# EAGLE design RS485_RELAY_V1 (EAGLE 6.3)
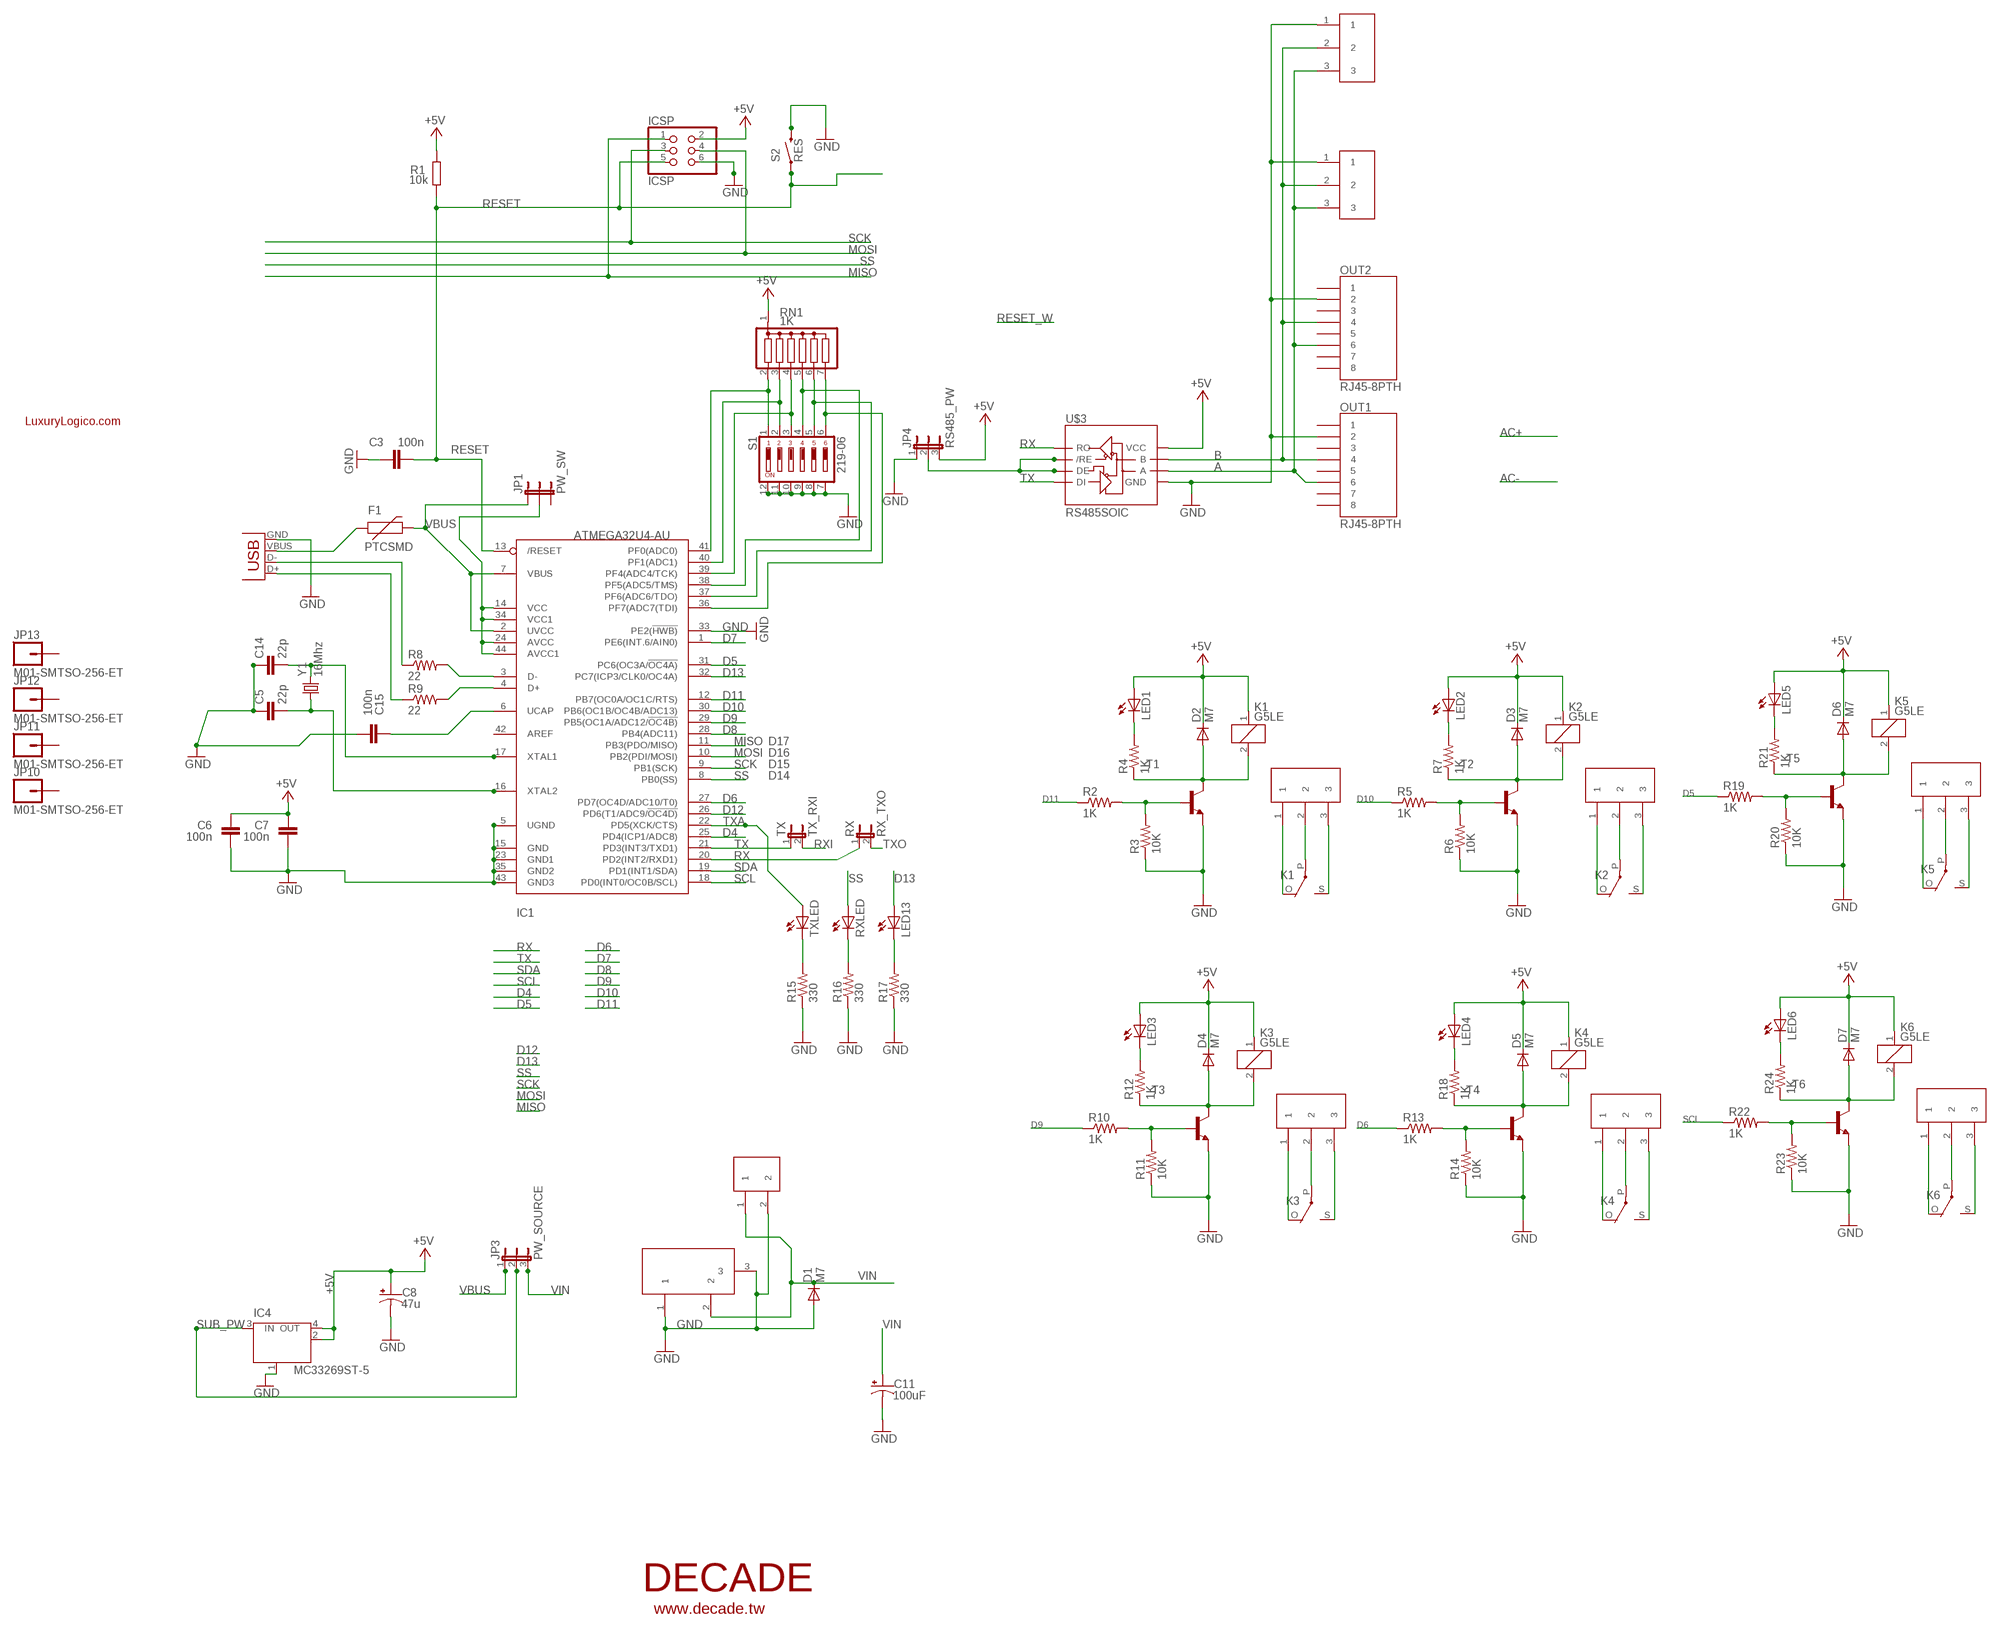
[diagram p0: schematic, sheet 1]

## Parts
C3  100n  C-EUC0603  [C0603-ROUND]
C5  22p  CAP0805  [0805]
C6  100n  C-EUC0603  [C0603-ROUND]
C7  100n  C-EUC0603  [C0603-ROUND]
C8  47u  CAP_POLE  [PANASONIC_E]
C11  100uF  CAP_POLE  [PANASONIC_E]
C14  22p  CAP0805  [0805]
C15  100n  C-EUC0603  [C0603-ROUND]
D1  M7  DIODE-SMB  [SMB]
D2  M7  DIODE-SMB  [SMB]
D3  M7  DIODE-SMB  [SMB]
D4  M7  DIODE-SMB  [SMB]
D5  M7  DIODE-SMB  [SMB]
D6  M7  DIODE-SMB  [SMB]
D7  M7  DIODE-SMB  [SMB]
F1  PTCSMD  [PTC-1206]
IC1  ATMEGA32U4-AU  [TQFP44]
IC4  MC33269ST-5  MC33269ST-3.3T3  [SOT223]
ICSP  ICSP  PINHD-2X3  [2X03]
JP1  PW_SW  JUMPER-3SMD  [SJ_3]
JP3  PW_SOURCE  JP2E  [JP2]
JP4  RS485_PW  JP2E  [JP2]
JP10  M01-SMTSO-256-ET  [SMTSO-256-ET]
JP11  M01-SMTSO-256-ET  [SMTSO-256-ET]
JP12  M01-SMTSO-256-ET  [SMTSO-256-ET]
JP13  M01-SMTSO-256-ET  [SMTSO-256-ET]
K1  G5LE  [G5LE]
K2  G5LE  [G5LE]
K3  G5LE  [G5LE]
K4  G5LE  [G5LE]
K5  G5LE  [G5LE]
K6  G5LE  [G5LE]
LED1  LEDCHIPLED_0805  [CHIPLED_0805]
LED2  LEDCHIPLED_0805  [CHIPLED_0805]
LED3  LEDCHIPLED_0805  [CHIPLED_0805]
LED4  LEDCHIPLED_0805  [CHIPLED_0805]
LED5  LEDCHIPLED_0805  [CHIPLED_0805]
LED6  LEDCHIPLED_0805  [CHIPLED_0805]
LED13  LEDCHIPLED_0805  [CHIPLED_0805]
OUT1  RJ45-8PTH  [RJ45-8]
OUT2  RJ45-8PTH  [RJ45-8]
R1  10k  R-EU_0603-RND  [R0603-ROUND]
R2  1K  RESISTOR0805-RES  [0805]
R3  10K  RESISTOR0805-RES  [0805]
R4  1K  RESISTOR0805-RES  [0805]
R5  1K  RESISTOR0805-RES  [0805]
R6  10K  RESISTOR0805-RES  [0805]
R7  1K  RESISTOR0805-RES  [0805]
R8  22  RESISTOR0805-RES  [0805]
R9  22  RESISTOR0805-RES  [0805]
R10  1K  RESISTOR0805-RES  [0805]
R11  10K  RESISTOR0805-RES  [0805]
R12  1K  RESISTOR0805-RES  [0805]
R13  1K  RESISTOR0805-RES  [0805]
R14  10K  RESISTOR0805-RES  [0805]
R15  330  RESISTOR0805-RES  [0805]
R16  330  RESISTOR0805-RES  [0805]
R17  330  RESISTOR0805-RES  [0805]
R18  1K  RESISTOR0805-RES  [0805]
R19  1K  RESISTOR0805-RES  [0805]
R20  10K  RESISTOR0805-RES  [0805]
R21  1K  RESISTOR0805-RES  [0805]
R22  1K  RESISTOR0805-RES  [0805]
R23  10K  RESISTOR0805-RES  [0805]
R24  1K  RESISTOR0805-RES  [0805]
RN1  1K  G06R  [SIL7]
RX  RX_TXO  JP1E  [JP1]
RXLED  LEDCHIPLED_0805  [CHIPLED_0805]
S1  219-06  [CTS-219-06]
S2  RES  SWITCH-MOMENTARY-2-SMD-1101NE  [TACTILE-SWITCH-1101NE]
T1  -NPN-SOT23-EBC  [SOT23-EBC]
T2  -NPN-SOT23-EBC  [SOT23-EBC]
T3  -NPN-SOT23-EBC  [SOT23-EBC]
T4  -NPN-SOT23-EBC  [SOT23-EBC]
T5  -NPN-SOT23-EBC  [SOT23-EBC]
T6  -NPN-SOT23-EBC  [SOT23-EBC]
TX  TX_RXI  JP1E  [JP1]
TXLED  LEDCHIPLED_0805  [CHIPLED_0805]
U$1  DECADE-5MM-CON-1X3  [DECADE-5MM-CON-1X3]
U$2  DECADE-5MM-CON-1X3  [DECADE-5MM-CON-1X3]
U$3  RS485SOIC  [SO08]
U$4  DECADE-5MM-CON-1X3  [DECADE-5MM-CON-1X3]
U$5  DECADE-5MM-CON-1X3  [DECADE-5MM-CON-1X3]
U$6  DECADE-5MM-CON-1X3  [DECADE-5MM-CON-1X3]
U$7  DECADE-5MM-CON-1X3  [DECADE-5MM-CON-1X3]
U$8  DECADE-5MM-CON-1X3  [DECADE-5MM-CON-1X3]
U$9  DECADE-5MM-CONN  [DECADE-5MM-CON-1X2]
U$10  DECADE-LOGO-SMALL  [DECADE-LOGO-SMALL]
U$11  DECADE-5MM-CON-1X3  [DECADE-5MM-CON-1X3]
U$13  LL-LUXURYLOGICO.COM  [DECADE-LL-LOGO-SMALL]
X1  DC21MMX  [DC-21MM]
X3  USBOLD  [USB-MINIB-OLD]
Y1  16Mhz  CRYSTAL5X3  [CRYSTAL-SMD-5X3]

## Nets
+5V [power]: C6.1 C7.1 C8.+ D2.C D3.C D4.C D5.C D6.C D7.C IC4.2(OUT) IC4.4(OUT) ICSP.2 JP4.3 K1.1 K2.1 K3.1 K4.1 K5.1 K6.1 LED1.A LED2.A LED3.A LED4.A LED5.A LED6.A R1.2 RN1.1 U$3.8(VCC)
A: OUT1.6 OUT2.6 U$1.3 U$3.6(A) U$11.3
B: OUT1.4 OUT2.4 U$1.2 U$3.7(B) U$11.2
D4: IC1.25(PD4(ICP1/ADC8))
D5: IC1.31(PC6(OC3A/!OC4A)) R19.1
D6: IC1.27(PD7(OC4D/ADC10/T0)) R13.1
D7: IC1.1(PE6(INT.6/AIN0))
D8: IC1.28(PB4(ADC11))
D9: IC1.29(PB5(OC1A/ADC12/!OC4B)) R10.1
D10: IC1.30(PB6(OC1B/OC4B/ADC13)) R5.1
D11: IC1.12(PB7(OC0A/OC1C/RTS)) R2.1
D12: IC1.26(PD6(T1/ADC9/!OC4D))
D13: IC1.32(PC7(ICP3/CLK0/OC4A)) LED13.A
GND [power]: C3.2 C5.1 C6.2 C7.2 C8.- C11.- C14.1 C15.2 D1.A IC1.5(UGND) IC1.15(GND) IC1.23(GND1) IC1.33(PE2(!HWB)) IC1.35(GND2) IC1.43(GND3) IC4.1(GND/ADJ) ICSP.6 JP4.1 OUT1.2 OUT2.2 R3.1 R6.1 R11.1 R14.1 R15.1 R16.1 R17.1 R20.1 R23.1 S1.7 S1.8 S1.9 S1.10 S1.11 S1.12 S2.P$2 T1.E T2.E T3.E T4.E T5.E T6.E U$1.1 U$3.5(GND) U$9.2 U$11.1 X1.1 X1.3 X3.GND
MISO: IC1.11(PB3(PDO/MISO)) ICSP.1
MOSI: IC1.10(PB2(PDI/MOSI)) ICSP.4
N$1: K1.P(2:P) U$2.2
N$2: LED1.C R4.2
N$3: D2.A K1.2 R4.1 T1.C
N$4: K1.O(2:O) U$2.1
N$5: R2.2 R3.2 T1.B
N$6: C5.2 IC1.16(XTAL2) Y1.1
N$7: C14.2 IC1.17(XTAL1) Y1.3
N$8: K1.S(2:S) U$2.3
N$9: LED2.C R7.2
N$10: D3.A K2.2 R7.1 T2.C
N$11: IC1.3(D-) R8.2
N$12: IC1.4(D+) R9.2
N$13: R8.1 X3.D-
N$14: R9.1 X3.D+
N$15: F1.1 X3.VBUS
N$16: R15.2 TXLED.C
N$17: R5.2 R6.2 T2.B
N$18: C15.1 IC1.6(UCAP)
N$19: IC1.14(VCC) IC1.24(AVCC) IC1.34(VCC1) IC1.44(AVCC1) JP1.2
N$20: K2.P(2:P) U$4.2
N$21: JP4.2 U$3.2(/RE) U$3.3(DE)
N$22: K2.O(2:O) U$4.1
N$23: K2.S(2:S) U$4.3
N$24: LED3.C R12.2
N$25: D4.A K3.2 R12.1 T3.C
N$26: R10.2 R11.2 T3.B
N$27: K3.P(2:P) U$5.2
N$28: K3.O(2:O) U$5.1
N$29: K3.S(2:S) U$5.3
N$30: LED4.C R18.2
N$31: D5.A K4.2 R18.1 T4.C
N$32: R13.2 R14.2 T4.B
N$33: K4.P(2:P) U$6.2
N$34: K4.O(2:O) U$6.1
N$35: K4.S(2:S) U$6.3
N$36: LED5.C R21.2
N$37: R16.2 RXLED.C
N$38: LED13.C R17.2
N$39: D6.A K5.2 R21.1 T5.C
N$40: IC1.41(PF0(ADC0)) RN1.2 S1.1
N$41: IC1.40(PF1(ADC1)) RN1.3 S1.2
N$42: IC1.39(PF4(ADC4/TCK)) RN1.4 S1.3
N$43: IC1.38(PF5(ADC5/TMS)) RN1.5 S1.4
N$44: IC1.37(PF6(ADC6/TDO)) RN1.6 S1.5
N$45: IC1.36(PF7(ADC7(TDI)) RN1.7 S1.6
N$46: R19.2 R20.2 T5.B
N$47: K5.P(2:P) U$7.2
N$48: K5.O(2:O) U$7.1
N$49: K5.S(2:S) U$7.3
N$50: LED6.C R24.2
N$51: D7.A K6.2 R24.1 T6.C
N$52: R22.2 R23.2 T6.B
N$53: K6.P(2:P) U$8.2
N$54: K6.O(2:O) U$8.1
N$55: K6.S(2:S) U$8.3
RESET: C3.1 IC1.13(/RESET) ICSP.5 R1.1 S2.P$1
RX: IC1.20(PD2(INT2/RXD1)) RX.1 U$3.1(RO)
RXI: TX.2
SCK: IC1.9(PB1(SCK)) ICSP.3
SCL: IC1.18(PD0(INT0/OC0B/SCL)) R22.1
SDA: IC1.19(PD1(INT1/SDA))
SS: IC1.8(PB0(SS)) RXLED.A
SUB_PW [VIN]: IC4.3(IN) JP3.2
TX: IC1.21(PD3(INT3/TXD1)) TX.1 U$3.4(DI)
TXA: IC1.22(PD5(XCK/CTS)) TXLED.A
TXO: RX.2
VBUS: F1.2 IC1.2(UVCC) IC1.7(VBUS) JP1.1 JP3.1
VIN [VIN]: C11.+ D1.C JP3.3 U$9.1 X1.2
Unconnected: IC1.42(AREF) JP1.3 JP10.P$1 JP11.P$1 JP12.P$1 JP13.P$1 OUT1.1 OUT1.3 OUT1.5 OUT1.7 OUT1.8 OUT2.1 OUT2.3 OUT2.5 OUT2.7 OUT2.8

## Notes on the sheet
- D17
- D16
- D15
- D14

## Library data of the parts
C3 C6 C7 C15 = SmartPrj:C-EU: CAPACITOR, European symbol
C5 C14 = SparkFun-Passives:CAP: Capacitor Standard 0603 ceramic capacitor, and 0.1" leaded capacitor.
C8 C11 = SparkFun-Passives:CAP_POL: Capacitor Polarized These are standard SMD and PTH capacitors. Normally 10uF, 47uF, and 100uF in electrolytic and tantalum varieties. Always verify the external diameter of the through hole cap, it varies with capacity, voltage, and manufacturer. The EIA devices should be standard.
D1-D7 = diode:DIODE-: DIODE
F1 = SparkFun-PowerIC:PTC: Resettable Fuse PTC Resettable Fuse. Spark Fun Electronics SKU : COM-08357
IC1 = adafruit:ATMEGA32U4: http://www.ladyada.net/library/eagle
IC4 = linear:MC33269ST*: Adjustable Output Low Dropout Voltage Regulator 800 mA Source: http://www.onsemi.com/pub/Collateral/MC33269-D.PDF
ICSP = pinhead:PINHD-2X3: PIN HEADER
JP1 = SparkFun-Passives:JUMPER-3
JP3 JP4 = jumper:JP2E: JUMPER
JP10-JP13 = SparkFun-Connectors:M01: Header 1 Standard 1-pin 0.1" header. Use with straight break away headers (SKU : PRT-00116), right angle break away headers (PRT-00553), swiss pins (PRT-00743), machine pins (PRT-00117), and female headers (PRT-00115).
K1-K6 = relay:G5LE: RELAY 1 x switch, 10 A/120 V AC, 8 A/30 V DC, Omron; OC_FARNELL: unknown; OC_NEWARK: unknown
LED1-LED6 LED13 RXLED TXLED = led:LED: LED OSRAM: - CHIPLED LG R971, LG N971, LY N971, LG Q971, LY Q971, LO R971, LY R971 LH N974, LH R974 LS Q976, LO Q976, LY Q976 LO Q996 - Hyper CHIPLED LW Q18S LB Q993, LB Q99A, LB R99A - SideLED LS A670, LO A670, LY A670, LG A670, LP A670 LB A673, LV A673, LT A673, LW A673 LH A674 LY A675 LS A676, LA A676, LO A676, LY A676, LW A676 LS A679, LY A679, LG A679 - Hyper Micro SIDELED® LS Y876, LA Y876, LO Y876, LY Y876 LT Y87S - SmartLED LW L88C, LW L88S LB L89C, LB L89S, LG L890 LS L89K, LO L89K, LY L89K LS L896, LA L896, LO L896, LY L896 - TOPLED LS T670, LO T670, LY T670, LG T670, LP T670 LSG T670, LSP T670, LSY T670, LOP T670, LYG T670 LG T671, LOG T671, LSG T671 LB T673, LV T673, LT T673, LW T673 LH T674 LS T676, LA T676, LO T676, LY T676, LB T676, LH T676, LSB T676, LW T676 LB T67C, LV T67C, LT T67C, LS T67K, LO T67K, LY T67K, LW E67C LS E67B, LA E67B, LO E67B, LY E67B, LB E67C, LV E67C, LT E67C LW T67C LS T679, LY T679, LG T679 LS T770, LO T770, LY T770, LG T770, LP T770 LB T773, LV T773, LT T773, LW T773 LH T774 LS E675, LA E675, LY E675, LS T675 LS T776, LA T776, LO T776, LY T776, LB T776 LHGB T686 LT T68C, LB T68C - Hyper Mini TOPLED® LB M676 - Mini TOPLED Santana® LG M470 LS M47K, LO M47K, LY M47K Source: http://www.osram.convergy.de LUXEON: - LUMILED® LXK2-PW12-R00, LXK2-PW12-S00, LXK2-PW14-U00, LXK2-PW14-V00 LXK2-PM12-R00, LXK2-PM12-S00, LXK2-PM14-U00 LXK2-PE12-Q00, LXK2-PE12-R00, LXK2-PE12-S00, LXK2-PE14-T00, LXK2-PE14-U00 LXK2-PB12-K00, LXK2-PB12-L00, LXK2-PB12-M00, LXK2-PB14-N00, LXK2-PB14-P00, LXK2-PB14-Q00 LXK2-PR12-L00, LXK2-PR12-M00, LXK2-PR14-Q00, LXK2-PR14-R00 LXK2-PD12-Q00, LXK2-PD12-R00, LXK2-PD12-S00 LXK2-PH12-R00, LXK2-PH12-S00 LXK2-PL12-P00, LXK2-PL12-Q00, LXK2-PL12-R00 Source: www.luxeon.com KINGBRIGHT: KA-3528ASYC Source: www.kingbright.com
OUT1 OUT2 = SparkFun-Connectors:RJ45-8: RJ45 Jack Simple RJ45, 8-pin connection - connector for common Cat5, Cat5e, and Cat6 Ethernet cables. Footprint not yet proven in production. Connector sku is PRT-00643; Breakout PCB sku is BOB-00716.
R1 = SmartPrj:R-EU_: RESISTOR, European symbol
R2 R3 R5 R6 R10 R11 R13 R14 R19 R20 R22 R23 = SparkFun-Resistors:RESISTOR: Resistor Basic schematic elements and footprints for 0603, 1206, and PTH resistors.
R4 R7-R9 R12 R15-R18 R21 R24 = SparkFun-Passives:RESISTOR: Resistor Basic schematic elements and footprints for 0603, 1206, and PTH resistors.
RN1 = resistor-sil:G06R: SIL RESISTOR; OC_FARNELL: unknown; OC_NEWARK: unknown
RX TX = jumper:JP1E: JUMPER
S1 = switch-dil:219-06*: Surface Mount DIP Switch Series 219 SMT CTS Electronic Components Sourc: www.ctscorp.com; OC_FARNELL: unknown; OC_NEWARK: unknown
S2 = SparkFun-Electromechanical:SWITCH-MOMENTARY-2: Various NO switches- pushbuttons, reed, etc
T1-T6 = transistor:*-NPN-: NPN Transistror BF959 corrected 2008.03.06
U$1 U$2 U$4-U$8 U$11 = DECADE-libraries:DECADE-5MM-CON-1X3
U$3 = SparkFun-DigitalIC:RS485: RS485 transceiver
U$9 = DECADE-libraries:DECADE-5MM-CONN
U$10 = DECADE-libraries:DECADE-LOGO-SMALL
U$13 = DECADE-libraries:LL-LUXURYLOGICO.COM
X1 = powersupply:DC21MM
X3 = SparkFun-Connectors:USB: USB Connectors USB-B-PTH is fully proven SKU : PRT-00139 USB-miniB is fully proven SKU : PRT-00587 USB-A-PCB is untested. USB-A-H is throughly reviewed, but untested. Spark Fun Electronics SKU : PRT-00437 USB-B-SMT is throughly reviewed, but untested. Needs silkscreen touching up. USB-A-S has not been used/tested USB-MB-H has not been used/tested
Y1 = SparkFun-FreqCtrl:CRYSTAL: Various standard crystals. Proven footprints. Spark Fun Electronics SKU : COM-00534

## Net classes
0 default: width 0.152 mm, drill 0.152 mm, clearance 0.152 mm
1 power: width 0.152 mm, drill 0.152 mm, clearance 0.152 mm
2 VIN: width 0.305 mm, drill 0.152 mm, clearance 0.305 mm

## Board
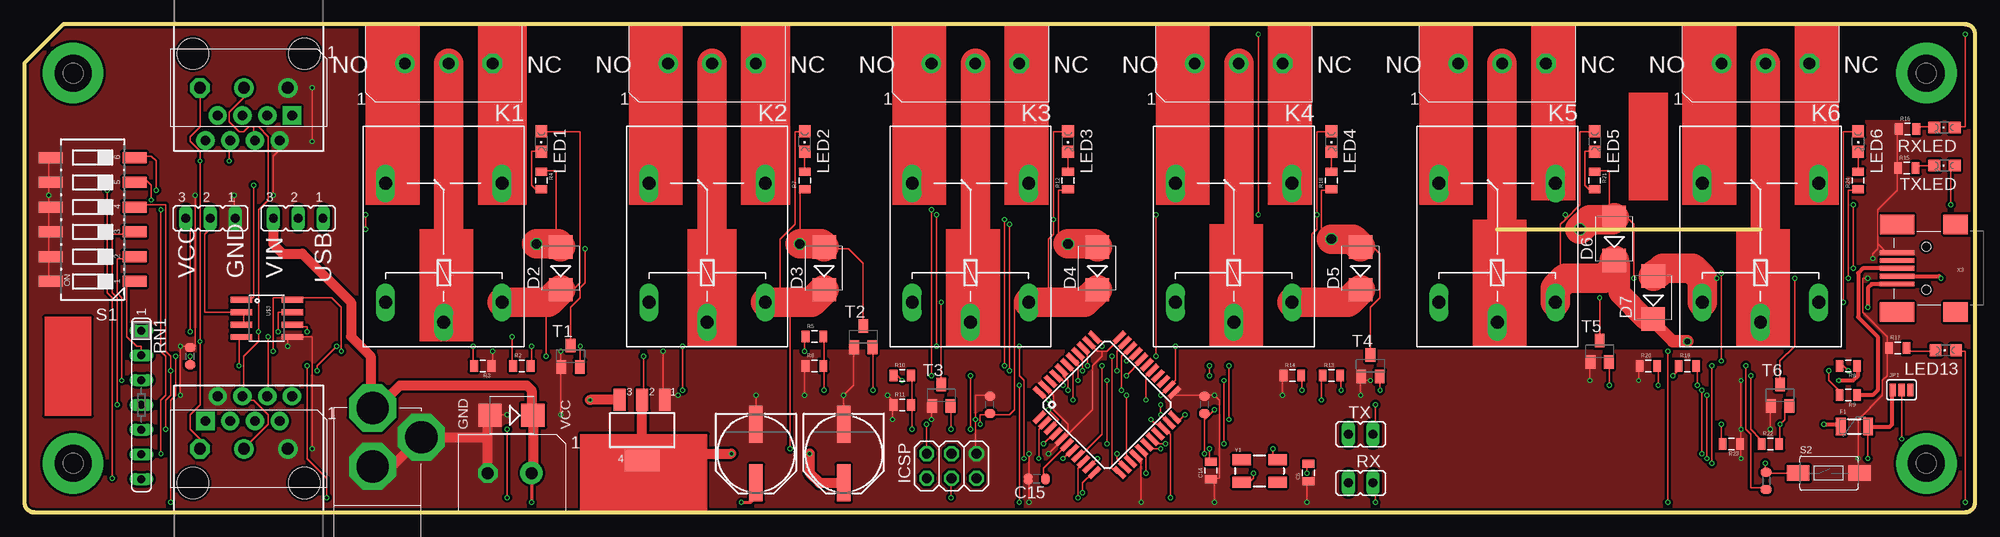
[diagram p1: board, top side]
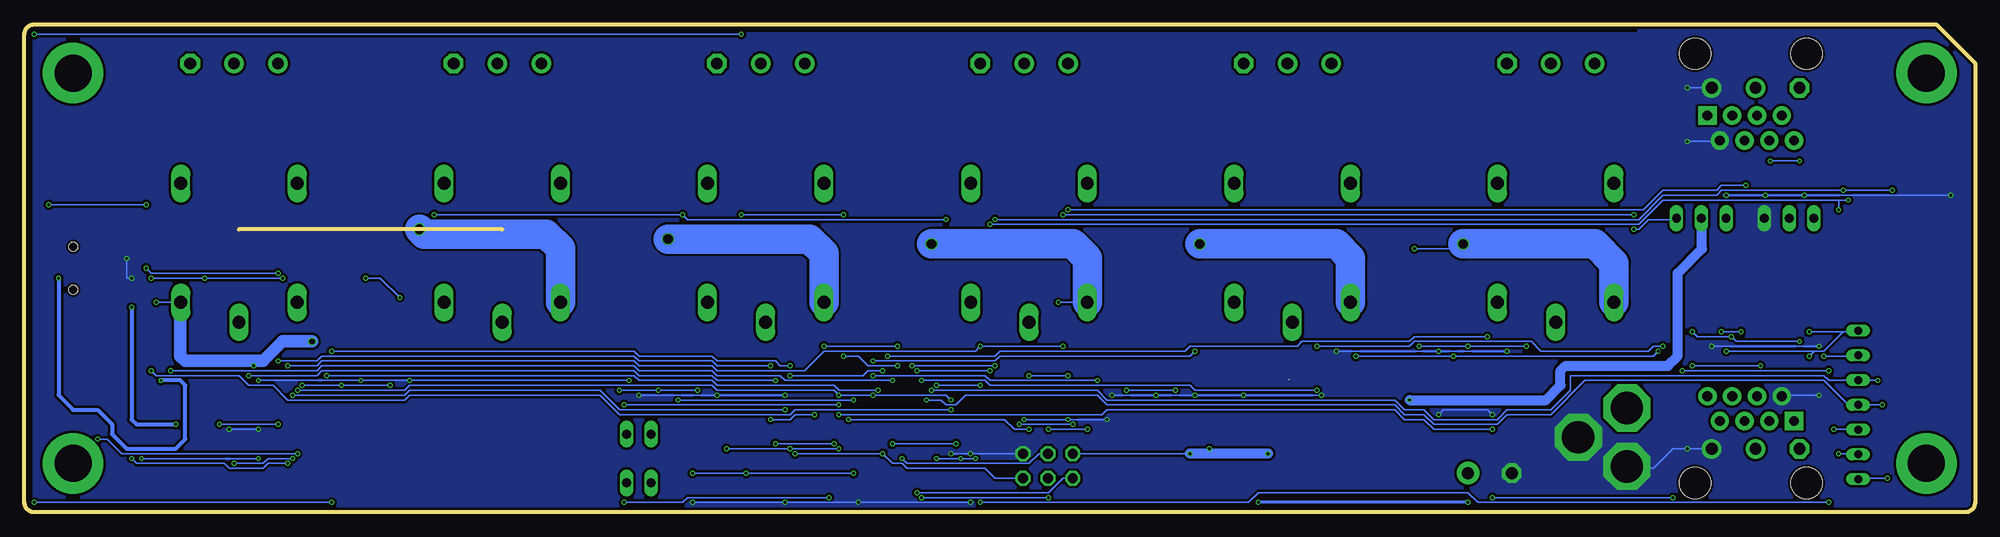
[diagram p2: board, bottom side, seen from below]

Size 200 x 50 mm. Coordinates in mm from the lower left corner, seen from the top.
Outline: 0,46 0,1 arc90 1,0 199,0 arc90 200,1 200,49 arc90 199,50 4,50 0,46
Copper layers (1*16): Top 0.035mm / dielectric 1.5mm / Bottom 0.035mm
Design rules "Fast_ChinaPCB-2012-6mil-off-MASK": minimum track width 6mil, minimum drill 0.3mm, track to track 6mil, track to pad 6mil, pad to pad 6mil, via to via 6mil, smd to smd 6mil, copper to edge 10mil, drill to drill 15mil, minimum pad ring 8mil, minimum via ring 4mil, stop-mask expansion 2mil, vias tented up to drill 13mil, thermal gap 10mil
Milling: 1 lines

### Footprints (pad centres in the part's own frame; a part is rotated, then mirrored left to right if it is on the bottom)
C0603-ROUND = smd 0.898 x 1.1: 1 -0.889,0; 2 0.889,0
0805 = smd 0.8 x 1.2: 1 -0.9,0; 2 0.9,0
PANASONIC_E = smd 3.8 x 1.4: + 3,0; - -3,0
SMB = smd 2.4 x 2.4: A 2.2,0; C -2.2,0
PTC-1206 = smd 1 x 1.8: 1 -1.4,0; 2 1.4,0
TQFP44 = smd 1.5 x 0.5: 1 -5.8,4; 2 -5.8,3.2; 3 -5.8,2.4; 4 -5.8,1.6; 5 -5.8,0.8; 6 -5.8,0; 7 -5.8,-0.8; 8 -5.8,-1.6; 9 -5.8,-2.4; 10 -5.8,-3.2; 11 -5.8,-4; 23 5.8,-4; 24 5.8,-3.2; 25 5.8,-2.4; 26 5.8,-1.6; 27 5.8,-0.8; 28 5.8,0; 29 5.8,0.8; 30 5.8,1.6; 31 5.8,2.4; 32 5.8,3.2; 33 5.8,4 | smd 0.5 x 1.5: 12 -4,-5.8; 13 -3.2,-5.8; 14 -2.4,-5.8; 15 -1.6,-5.8; 16 -0.8,-5.8; 17 0,-5.8; 18 0.8,-5.8; 19 1.6,-5.8; 20 2.4,-5.8; 21 3.2,-5.8; 22 4,-5.8; 34 4,5.8; 35 3.2,5.8; 36 2.4,5.8; 37 1.6,5.8; 38 0.8,5.8; 39 0,5.8; 40 -0.8,5.8; 41 -1.6,5.8; 42 -2.4,5.8; 43 -3.2,5.8; 44 -4,5.8
SOT223 = smd 1.219 x 2.235: 1 -2.311,-3.099; 2 0,-3.099; 3 2.311,-3.099 | smd 3.6 x 2.2: 4 0,3.099
2X03 = drill 1.016 octagon: 1 -2.54,-1.27; 2 -2.54,1.27; 3 0,-1.27; 4 0,1.27; 5 2.54,-1.27; 6 2.54,1.27
SJ_3 = smd 0.635 x 1.27: 1 -0.889,0; 2 0,0; 3 0.889,0
JP2 = drill 0.914 long: 1 -2.54,0; 2 0,0; 3 2.54,0
SMTSO-256-ET = drill 3.81 pad 6.198: P$1 0,0
G5LE = drill 1.321 long: 1 -7.493,-5.969; 2 -7.493,5.969; O 4.699,5.969; P -9.525,0; S 4.699,-5.969
CHIPLED_0805 = smd 1.2 x 1.2: A 0,-1.05; C 0,1.05
RJ45-8 = drill 1 pad 1.88 square: 1 -4.445,6.35 | drill 1 pad 1.88: 2 -3.175,8.89; 3 -1.905,6.35; 4 -0.635,8.89; 5 0.635,6.35; 6 1.905,8.89; 7 3.175,6.35; 8 4.445,8.89 | hole 3.2: -5.715,0; 5.715,0
R0603-ROUND = smd 0.898 x 1.1: 1 -0.889,0; 2 0.889,0
SIL7 = drill 0.813 long: 1 -7.62,0; 2 -5.08,0; 3 -2.54,0; 4 0,0; 5 2.54,0; 6 5.08,0; 7 7.62,0
JP1 = drill 0.914 long: 1 0,-1.27; 2 0,1.27
CTS-219-06 = smd 1.13 x 2.44: 1 -6.35,-4.3; 2 -3.81,-4.3; 3 -1.27,-4.3; 4 1.27,-4.3; 5 3.81,-4.3; 6 6.35,-4.3; 7 6.35,4.3; 8 3.81,4.3; 9 1.27,4.3; 10 -1.27,4.3; 11 -3.81,4.3; 12 -6.35,4.3
TACTILE-SWITCH-1101NE = smd 2.3 x 1.6: P$1 -3.15,0; P$2 3.15,0
SOT23-EBC = smd 1 x 1.4: B 0.95,-1.1; C 0,1.1; E -0.95,-1.1
DECADE-5MM-CON-1X3 = drill 1.2 pad 2: 1 9,0; 2 4.5,0 | drill 1.2 pad 2 octagon: 3 0,0
SO08 = smd 0.61 x 2.21: 1 -1.905,-2.616; 2 -0.635,-2.616; 3 0.635,-2.616; 4 1.905,-2.616; 5 1.905,2.616; 6 0.635,2.616; 7 -0.635,2.616; 8 -1.905,2.616
DECADE-5MM-CON-1X2 = drill 1.2 pad 2.3: 1 4.5,0 | drill 1.2 pad 2 octagon: 2 0,0
DC-21MM = drill 3.302 pad 4.826 octagon: 1 -5.08,-3.353; 2 -0.076,-6.35; 3 -0.076,-0.356
USB-MINIB-OLD = smd 2.5 x 2: 1 -3,-4.5; 2 -3,4.5 | smd 3.5 x 2: 3 3,-4.5; 4 3,4.5 | smd 3.5 x 0.5: D+ 3,0; D- 3,0.8; GND 3,-1.6; ID 3,-0.8; VBUS 3.01,1.61 | hole 0.9: 0,2.2; 0,-2.2
CRYSTAL-SMD-5X3 = smd 1.9 x 1.1: 1 -1.85,-1.15; 2 1.85,-1.15; 3 1.85,1.15; 4 -1.85,1.15

### Placement (x,y rotation side)
C3  121,11 90 top
C5  131.65,4.06 90 top
C6  17,16 90 top
C7  99,11 90 top
C8  84,6 270 top
C11  75,6 270 top
C14  121.65,4.27 90 top
C15  103.8,3.41 180 top
D1  49.95,9.93 180 top
D2  55,25 90 top
D3  82,25 90 top
D4  110,25 90 top
D5  137,25 90 top
D6  163,28 90 top
D7  167,22 90 top
F1  187.63,8.78 0 top
IC1  111,11 45 top
IC4  63.35,8.41 180 top
ICSP  95.06,4.74 0 top
JP1  192.46,12.54 0 top
JP3  28.07,30.13 180 top
JP4  19.07,30.13 180 top
JP10  195,5 0 top
JP11  5,5 0 top
JP12  195,45 0 top
JP13  5,45 0 top
K1  43,29 90 top
K2  70,29 90 top
K3  97,29 90 top
K4  124,29 90 top
K5  151,29 90 top
K6  178,29 90 top
LED1  53,38 180 top
LED2  80,38 180 top
LED3  107,38 180 top
LED4  134,38 180 top
LED5  161,38 180 top
LED6  188,38 180 top
LED13  196.99,16.59 90 top
OUT1  23,47 180 top
OUT2  23,3 0 top
R1  178.57,3.22 270 top
R2  51,15 0 top
R3  47,15 180 top
R4  53,34 270 top
R5  81,18 0 top
R6  81,15 0 top
R7  80,34 90 top
R8  187,15 180 top
R9  187,12 180 top
R10  90,14 0 top
R11  90,11 0 top
R12  107,34 90 top
R13  134,14 0 top
R14  130,14 0 top
R15  192.99,35.27 0 top
R16  193.07,39.27 0 top
R17  192.07,16.84 0 top
R18  134,34 90 top
R19  170.5,15 0 top
R20  166.5,15 0 top
R21  161,34 270 top
R22  179,7 0 top
R23  175,7 180 top
R24  188,34 90 top
RN1  12,11 270 top
RX  137,3 90 top
RXLED  196.86,39.43 90 top
S1  7,30 90 top
S2  185,4 0 top
T1  56,16 0 top
T2  86,18 0 top
T3  94,12 0 top
T4  138,15 0 top
T5  161.5,16.5 0 top
T6  180,12 0 top
TX  137,8 90 top
TXLED  196.86,35.53 90 top
U$1  18,43.5 0 top
U$2  48,46 180 top
U$3  24.86,19.86 270 top
U$4  75,46 180 top
U$5  102,46 180 top
U$6  129,46 180 top
U$7  156,46 180 top
U$8  183,46 180 top
U$9  47.5,4 0 top
U$10  2,20 270 top
U$11  18,6.5 0 top
U$13  168.5,32 90 top
X1  35.62,4.33 180 top
X3  195,25 180 top
Y1  126.63,4.22 0 top

### Tracks (layer width: path | path; a pad name or v marks a point on that pad's centre or on a via)
+5V  (via drill 0.3, 0.6)
  Top 0.152: 132,21.51 132,28.5 132.5,29 v132.5,30.5 132.5,39 134,39 LED4.A | v176.5,15 176.5,8.5 177,8 177,2.5 178.5,2.5 R1.2 | 158,30 157.5,29.5 157.5,25 158,24 | 158,30 159.5,31.5 159.5,39 161,39 LED5.A | v186.5,21.5 186.5,39 188,39 LED6.A | 158,30 v158,30.5 | v17,16 C6.1 | v25.5,16.5 25.5,22 27,22 U$3.8 27.5,22 31.5,22 32.5,21 v32.5,16.5 | v17,18.5 17,30 JP4.3 | LED1.A 53,39 57,39 57,23.5 56,22.5 D2.C | 77.5,21.51 77.5,28 79,29.5 79,39 80,39 LED2.A | 105,21.51 105,28 105.5,28.5 v105.5,30 105.5,39 107,39 LED3.A | 99,10 98,10 v98,9 | v92.5,9 92.5,6.5 ICSP.2 | 99,10 101,10 101.5,10.5 101.5,21.5 K3.1 | 99,10 C7.1 | v78.5,6.5 78.5,21.51 | v53.5,16 53.5,21.51 | v63.5,16 63.5,12 IC4.2
  Top 1.016: IC4.2 IC4.4 67.81,5.32 68.5,6 v72.5,6 | v80.5,6 80.5,4 81.5,3 C8.+
  Top 1.27: D7.C 167,19.5 169,17.5 v170.5,17.5
  Top 2.184: D7.C 166.2,19.8 163.5,22.5 163.5,25.3 D6.C
  Top 3: K1.1 53.5,21.51 53.71,21.51 D2.C | K2.1 77.5,21.51 78.5,21.51 80.71,21.51 D3.C | K3.1 105,21.51 108.71,21.51 D4.C | K4.1 132,21.51 135.71,21.51 D5.C | K5.1 156.97,22.97 158,24 162,24 163,25 D6.C
  Bottom 0.152: v176.5,15 176.5,15.5 | v186.5,21.5 184.5,21.5 K6.1 | v158,30.5 v132.5,30.5 132,30 v105.5,30 | 16.5,16.5 v17,16 | 16.5,16.5 15.5,16.5 13.5,18.5 | 13.5,18.5 12,18.5 RN1.1 | 16.5,16.5 v25.5,16.5 | 13.5,18.5 v17,18.5 | v92.5,9 v98,9 | v80.5,6 92.5,6 ICSP.2 | v78.5,6.5 78.5,6 | v63.5,16 v53.5,16 33,16 v32.5,16.5
  Bottom 1.016: v72.5,6 78.5,6 v80.5,6
  Bottom 1.27: v170.5,17.5 173.5,17.5 175.5,15.5 176.5,15.5 183.5,15.5 184,16 184,21.48 K6.1
A  (via drill 0.3)
  Top 0.152: v29,18.5 29,19 27.5,19 U$3.6 | v25,18 25,12 OUT2.6 | U$1.3 18,39.5 17,38.5 17,38 18,37 v18,36 v18,17.5 18,11 17,10 17,8.5 18,7.5 U$11.3 | v21,36 21,38 OUT1.6
  Bottom 0.152: v29,18.5 28.5,18 v25,18 24.5,17.5 v18,17.5 | v18,36 v21,36
B  (via drill 0.3)
  Top 0.152: U$11.2 22.5,7 23,7 25,9 25,10 23.5,11.5 22.5,11.5 OUT2.4 22.5,12 22.5,16 24,17.5 v24,18.5 24,31 25,32 25,38.5 24,39.5 23.5,39.5 | U$1.2 22.5,42.5 21,41 21,40 22,39 22.5,39 23,39.5 23.5,39.5 | v26,18.5 26,20.5 27,20.5 U$3.7 | 23.5,39.5 23.5,38.5 OUT1.4
  Bottom 0.152: v24,18.5 v26,18.5
D5  (via drill 0.3)
  Top 0.152: v169,14 169.5,14.5 169.5,15 R19.1 | v112.5,12.5 112.5,16 113,16.5 IC1.31
  Bottom 0.152: v169,14 137.5,14 137,13.5 129.5,13.5 129,13 117,13 116.5,12.5 v112.5,12.5
D6  (via drill 0.3)
  Top 0.152: v133,11.5 133,14 R13.1 | v115,11.5 115,14 115.5,14.5 IC1.27
  Bottom 0.152: v115,11.5 v133,11.5
D9  (via drill 0.3)
  Top 0.152: v90,13.5 89.5,14 R10.1 89,14 | v113,14 114.5,15.5 IC1.29
  Bottom 0.152: v90,13.5 101,13.5 101.5,14 v113,14
D10  (via drill 0.3)
  Top 0.152: v80,16.5 80,18 R5.1 | v113,15.5 113.5,16 IC1.30
  Bottom 0.152: v80,16.5 80.5,16 100,16 100.5,15.5 v113,15.5
D11  (via drill 0.3)
  Top 0.152: v50,18 50,15 R2.1 | v111.5,16 111.5,4.5 112,4 IC1.12
  Bottom 0.152: v50,18 57.5,18 58,17.5 69,17.5 69.5,17 80.5,17 81,16.5 100,16.5 100.5,16 v111.5,16
D13  (via drill 0.3)
  Top 0.152: v199,1 199,16.5 198.5,16.5 LED13.A | v168.5,16.5 v168.5,1 | v121.5,14 v121.5,15 | v112,14.5 112,16.5 112.5,17 IC1.32
  Bottom 0.152: v168.5,1 v199,1 | v168.5,16.5 137.5,16.5 137,16 129.5,16 129,15.5 123,15.5 122.5,15 v121.5,15 | v121.5,14 114,14 113.5,14.5 v112,14.5
GND  (via drill 0.3)
  Top 0.152: R16.1 192,39 192,35.5 R15.1 192,35 192,33 190,31 190,27.5 | 190,27.5 191,26.5 192,26.5 X3.GND | S2.P$2 188,4 v188,5.5 188,9.5 190.5,12 190.5,13.5 191,14 191,16.5 R17.1 191,17 191,18 188.5,20.5 188.5,24 v189,24 | v165.5,13.5 165.5,15 R20.1 | v160.5,13.5 160.5,15 T5.E | 176,7 v176,8.5 v176,13.5 | v179,8.5 179,10.5 T6.E | 176,7 v176,5.5 | 176,7 R23.1 | 190,27.5 190,27 189.5,26.5 v189.5,26 | 17,17 v16,17 v16,12 | v27,17 27,18 U$3.5 27.5,18 29.5,18 v29.5,6.5 | S1.7 2.5,36 2.5,34 S1.8 2.5,33.5 v2.5,32.5 2.5,31.5 S1.9 2.5,31 2.5,29 S1.10 2.5,28.5 2.5,26.5 S1.11 2.5,26 2.5,24 S1.12 | v21.5,32.5 21.5,30.5 JP4.1 | v25.5,32.5 25.5,36.5 26,37 26,38 OUT1.2 | v29.5,38 v29.5,43.5 | 17,17 17.5,17 v17.5,32.5 | 17,17 C6.2 | v48,16.5 48,15 R3.1 | v55,16.5 55,15 T1.E 55,14.5 v55,10 | v65.5,16.5 65.5,12 IC4.1 66,12 v67,12 | v49.5,10 48,10 D1.A | 121,12 118,12 IC1.23 | 121,12 v122,12 122.5,11.5 122.5,3.5 122,3.5 C14.1 122,3 v122,1 | 121,12 C3.2 | v131.5,1 131.5,3 C5.1 | v129,12 129,14 R14.1 | v137,12 137,13.5 T4.E 137.5,13.5 v138,13.5 | v114.5,1 114.5,5.5 114,5.5 IC1.15 | v80,12 80,15 R6.1 | C8.- v84,12 85,13 85,16.5 T2.E | v75,12 C11.- | v89,9.5 89,11 | v93,9.5 93,10.5 T3.E | 110.5,16.5 111,16.5 112,17.5 IC1.33 | 110.5,16.5 110,16.5 109.5,17 IC1.35 | v103,6 103,3.5 C15.2 103,3 v103,1 | C7.2 99,12 97.5,12 v97.5,9.5 97.5,6.5 ICSP.6 | v105,6 106,7 IC1.5 106.5,7.5 107,8 | 107,8 107,9 105.5,10.5 105.5,12 105,12.5 IC1.43 | 110.5,16.5 110.5,16 109.5,15 109.5,10.5 107,8 | v88.5,12 89,11.5 89,11 | 89,11 R11.1
  Top 1.016: U$9.2 47.5,8 | 47.5,8 47.5,9.68 D1.A | X1.3 37.7,4.69 X1.1 47.19,7.69 47.5,8
  Bottom 0.152: v179,8.5 v176,8.5 | v176,13.5 v165.5,13.5 v160.5,13.5 v138,13.5 | v176,5.5 v188,5.5 | v189.5,26 189.5,24 v189,24 | v16,12 19.5,12 OUT2.2 | v16,17 v27,17 | v25.5,32.5 v21.5,32.5 v17.5,32.5 v2.5,32.5 | v29.5,43.5 U$1.1 | v29.5,38 26.5,38 OUT1.2 | U$11.1 v29.5,6.5 31,6.5 33,4.5 35.5,4.5 X1.3 | v48,16.5 v55,16.5 v65.5,16.5 | v49.5,10 50,10.5 54.5,10.5 v55,10 | v131.5,1 v122,1 v114.5,1 v103,1 | v122,12 v129,12 v137,12 | v89,9.5 v93,9.5 v97.5,9.5 | ICSP.6 98,6 v103,6 v105,6 | v88.5,12 v84,12 v80,12 v75,12 v67,12
  pour Top (isolate 0.254, no thermals): 0,50 34,50 34,16.5 187,16.5 187,40 199.5,40 199.5,0.5 0.5,0.5 0.5,49.5 0,49.5
  pour Bottom (isolate 0.254, no thermals): 0.5,49.5 34.5,49.5 34.5,49 199,49 199,0.5 0.5,0.5
MISO  (via drill 0.3)
  Top 0.152: v108.5,2 108.5,3 109.5,4 IC1.11
  Bottom 0.152: v108.5,2 95,2 93.5,3.5 93,3.5 ICSP.1
MOSI  (via drill 0.3)
  Top 0.152: v110,5.5 109.5,5 IC1.10
  Bottom 0.152: v110,5.5 109.5,5 97,5 96,6 95.5,6 ICSP.4
N$1
  Top 3: U$2.2 43.5,19.98 K1.P
N$2
  Top 0.152: LED1.C 53,37 52,37 52,33.5 52.5,33 53,33 R4.2
N$3  (via drill 0.3, 1)
  Top 0.152: 54.5,27.5 54.5,35 53,35 R4.1 | T1.C 56,21 57,22 57,23 57.5,23.5 v57.5,27
  Top 3: v52.5,27.5 54.5,27.5 54.7,27.5 D2.A
  Bottom 0.152: v57.5,27 53.5,27 v52.5,27.5
  Bottom 3: K1.2 37.03,25.53 39,27.5 v52.5,27.5
N$4
  Top 3: U$2.1 39,35.67 K1.O
N$5  (via drill 0.3)
  Top 0.152: v46,17 46,15 R3.2 | v52,17 52,15 R2.2 | v57,17 57,15 T1.B
  Bottom 0.152: v46,17 v52,17 v57,17
N$6  (via drill 0.3)
  Top 0.152: v131.5,4 131.5,5 C5.2 | v126,4 126,3.5 125.5,3 125,3 Y1.1 | v115,4 115,6 IC1.16
  Bottom 0.152: v131.5,4 v126,4 v115,4
N$7  (via drill 0.3)
  Top 0.152: v121.5,6.5 121.5,5.5 C14.2 | v116.5,6.5 115.5,6.5 IC1.17 | v128,6.5 128,5.5 Y1.3
  Bottom 0.152: v116.5,6.5 v121.5,6.5 v128,6.5
N$8
  Top 3: U$2.3 48,34.67 K1.S
N$9
  Top 0.152: R7.2 LED2.C
N$10  (via drill 1)
  Top 0.152: v79.5,27.5 79.5,33 80,33 R7.1 | T2.C 86,25.5 84.5,27 83,27 D3.A
  Top 3: v79.5,27.5 81.7,27.5 D3.A
  Bottom 3: K2.2 64.03,26.03 65.5,27.5 v79.5,27.5
N$11  (via drill 0.3)
  Top 0.152: v187,14.5 186.5,15 R8.2 186,15 | v105,10.5 106,9.5 105.5,9 IC1.3
  Bottom 0.152: v187,14.5 186.5,14 178,14 177,13 174.5,13 173,11.5 161,11.5 160.5,12 141,12 139,10 121.5,10 121,10.5 v105,10.5
N$12  (via drill 0.3)
  Top 0.152: v185,14.5 185,13.5 186,12.5 186,12 R9.2 | v111,7 v111,13.5 | v104.5,7 105.5,8 IC1.4
  Bottom 0.152: v185,14.5 170,14.5 169.5,15 137.5,15 137,14.5 129.5,14.5 129,14 122.5,14 122,13.5 v111,13.5 | v104.5,7 v111,7
N$13  (via drill 0.3)
  Top 0.406: X3.D- 196.3,24.2 v196.5,24 | v186,13.5 187.5,13.5 188,14 188,14.9 R8.1
  Bottom 0.406: v196.5,24 196.5,12 195,10.5 192.5,10.5 191,9 191,8 189.5,6.5 184.5,6.5 183.5,7.5 183.5,13 184,13.5 v186,13.5
N$14
  Top 0.406: X3.D+ 188.5,25 188,24.5 188,20 190,18 190,12.5 189.5,12 R9.1
N$15  (via drill 0.3)
  Top 0.406: X3.VBUS 189.39,23.39 189,23 v189,21 | v184.5,9 186.01,9 F1.1
  Bottom 0.406: v189,21 189,9.5 188.5,9 v184.5,9
N$16
  Top 0.152: R15.2 194,35.5 195.5,35.5 TXLED.C
N$17  (via drill 0.3)
  Top 0.152: 82,15 82,18 R5.2 | v87,12.5 87,16.5 T2.B | 82,15 v82,12.5 | 82,15 R6.2
  Bottom 0.152: v82,12.5 v87,12.5
N$18
  Top 0.152: IC1.6 104.5,4.5 104.5,3.5 C15.1
N$19  (via drill 0.3)
  Top 0.152: v192.5,7.5 192.5,12.5 JP1.2 | v172,12.5 v172,6 | v116.5,12 117,12.5 IC1.24 117.5,13 118,13.5 v118,17 | v105,11.5 104.5,12 IC1.44 | v113,12 113,5.5 IC1.14 | v110.5,17 110.5,17.5 110,17.5 IC1.34
  Bottom 0.152: v192.5,7.5 191.5,7.5 190,6 v172,6 | v172,12.5 161,12.5 160.5,13 129.5,13 129,12.5 117,12.5 v116.5,12 v113,12 105.5,12 v105,11.5 | v118,17 v110.5,17
N$20
  Top 3: U$4.2 70.5,19.98 K2.P
N$21
  Top 0.152: U$3.3 22.5,19.5 22.5,20.5 U$3.2 22,20.5 18.5,20.5 18.5,28.5 19,29 19,30 JP4.2
N$22
  Top 3: U$4.1 66,35.67 K2.O
N$23
  Top 3: U$4.3 75,34.67 K2.S
N$24
  Top 0.152: R12.2 LED3.C
N$25  (via drill 0.3, 1)
  Top 0.152: R12.1 107,33 106,33 106,28.5 v107,27.5 | v94,21.5 T3.C
  Top 3: v107,27.5 109.7,27.5 D4.A
  Bottom 0.152: v94,21.5 92.5,21.5 K3.2
  Bottom 3: K3.2 91.03,26.03 92.5,27.5 v107,27.5
N$26  (via drill 0.3)
  Top 0.152: 91,11 91,14 R10.2 | v95,8.5 95,10.5 T3.B | 91,11 v91,8.5 | 91,11 R11.2
  Bottom 0.152: v91,8.5 v95,8.5
N$27
  Top 3: U$5.2 97.5,19.98 K3.P
N$28
  Top 3: U$5.1 93,35.67 K3.O
N$29
  Top 3: U$5.3 102,34.67 K3.S
N$30
  Top 0.152: R18.2 LED4.C
N$31  (via drill 1)
  Top 0.152: R18.1 134,33 133,33 133,29 v134,28 | T4.C 138,21 139,22 139,26.5 138,27.5 D5.A
  Top 3: v134,28 136.2,28 D5.A
  Bottom 3: K4.2 118.03,26.53 119.5,28 v134,28
N$32  (via drill 0.3)
  Top 0.152: v131,12.5 131,14 R14.2 | v135,12.5 135,14 R13.2 | v139,12.5 139,13.5 T4.B
  Bottom 0.152: v131,12.5 v135,12.5 v139,12.5
N$33
  Top 3: U$6.2 124.5,19.98 K4.P
N$34
  Top 3: U$6.1 120,35.67 K4.O
N$35
  Top 3: U$6.3 129,34.67 K4.S
N$36
  Top 0.152: LED5.C 161,37 160,37 160,33.5 160.5,33 161,33 R21.2
N$37
  Top 0.152: R16.2 194,39.5 195.5,39.5 RXLED.C
N$38
  Top 0.152: R17.2 193,16.5 195.5,16.5 LED13.C
N$39  (via drill 0.3, 1)
  Top 0.152: R21.1 161,35 162.5,35 162.5,31.5 D6.A 164,30.5 165,29.5 v165,24 | v161.5,22 T5.C
  Top 3: v159.5,29 160.5,30 162.8,30 D6.A
  Bottom 0.152: v161.5,22 163.5,24 v165,24
  Bottom 3: K5.2 145.03,27.03 146.5,28.5 159,28.5 v159.5,29
N$40  (via drill 0.3)
  Top 0.152: v106.5,13 106.5,13.5 106,13.5 IC1.41 | v102,1 v102,13 | v15,1 15,11.5 15.5,12 v15.5,16 | RN1.2 12,17 11.5,17 10.5,18 10.5,23.5 11,23.5 S1.1
  Bottom 0.152: v102,13 v106.5,13 | v102,1 74.5,1 73.5,2 52,2 51,1 v15,1 | v15.5,16 12,16 RN1.2
N$41  (via drill 0.3)
  Top 0.152: v107,12.5 107,13.5 106.5,14 106.5,14.5 IC1.40 | v10,13.5 10,22 9.5,22.5 9.5,26 11,26 S1.2
  Bottom 0.152: v107,12.5 90,12.5 89,11.5 59.5,11.5 58.5,10.5 56.5,10.5 55.5,9.5 49,9.5 48,10.5 43.5,10.5 41.5,12.5 41.5,14 15.5,14 15,13.5 12,13.5 | 12,13.5 v10,13.5 | 12,13.5 RN1.3
N$42  (via drill 0.3)
  Top 0.152: v107.5,11.5 107.5,14.5 107,15 IC1.39 | v9.5,11 9.5,22 9,22.5 9,28.5 11,28.5 S1.3
  Bottom 0.152: v107.5,11.5 106,11.5 105.5,11 104.5,11 103.5,12 90,12 89,11 59.5,11 58.5,10 56.5,10 55.5,9 49,9 48,10 43.5,10 40,13.5 15.5,13.5 13,11 RN1.4 v9.5,11
N$43  (via drill 0.3)
  Top 0.152: v108,13.5 108,15.5 107.5,15.5 IC1.38 | v67.5,17 v67.5,12.5 | v32,17 30,15 v30,14.5 | v14.5,8.5 14.5,11.5 15,12 v15,14.5 15,16 14.5,16.5 14.5,31.5 11.5,31.5 S1.4
  Bottom 0.152: v108,13.5 101.5,13.5 101,13 80.5,13 80,12.5 v67.5,12.5 | v67.5,17 58,17 57.5,17.5 45.5,17.5 44.5,16.5 33.5,16.5 33,17 v32,17 | v15,14.5 v30,14.5 | v14.5,8.5 12,8.5 RN1.5
N$44  (via drill 0.3)
  Top 0.152: v108.5,14.5 108.5,16 IC1.37 | v101,29.5 v101,14.5 | v13,32 13,33.5 12.5,34 11.5,34 S1.5 | v14,6 14,11.5 14.5,12 14.5,16 14,16.5 v14,31
  Bottom 0.152: v101,14.5 v108.5,14.5 | v101,29.5 34.5,29.5 32,32 14,32 | v13,32 14,32 | v14,6 12,6 RN1.6 | 14,32 v14,31
N$45  (via drill 0.3)
  Top 0.152: v109,15 109,16.5 IC1.36 | v100.5,30 v100.5,15 | v13.5,33 13.5,36 13,36.5 11.5,36.5 S1.6 | v9,3.5 9,22 8.5,22.5 v8.5,33
  Bottom 0.152: v100.5,15 v109,15 | v100.5,30 34.5,30 32,32.5 26.5,32.5 26,33 v13.5,33 v8.5,33 | v9,3.5 12,3.5 RN1.7
N$46  (via drill 0.3)
  Top 0.152: v167.5,13 167.5,15 R20.2 | v171.5,13 171.5,15 R19.2 | v162.5,13 162.5,15 T5.B
  Bottom 0.152: v171.5,13 v167.5,13 v162.5,13
N$47
  Top 3: U$7.2 151.5,19.98 K5.P
N$48
  Top 3: U$7.1 147,35.67 K5.O
N$49
  Top 3: U$7.3 156,34.67 K5.S
N$50
  Top 0.152: R24.2 LED6.C
N$51  (via drill 0.3)
  Top 0.152: v187,24 187,33 188,33 R24.1 | v173.5,24 172.03,23.97 | T6.C 180,15.5 181.5,17 v181.5,24
  Top 3: K6.2 172.03,23.97 171,25 168,25 167.5,24.5 167.3,24.5 D7.A
  Bottom 0.152: v173.5,24 v181.5,24 v187,24
N$52  (via drill 0.3)
  Top 0.152: v174,9 174,7 R23.2 | R22.2 180,7 v180,9 180.5,9.5 180.5,10.5 T6.B
  Bottom 0.152: v180,9 v174,9
N$53
  Top 3: U$8.2 178.5,19.98 K6.P
N$54
  Top 3: U$8.1 174,35.67 K6.O
N$55
  Top 3: U$8.3 183,34.67 K6.S
RESET  (via drill 0.3)
  Top 0.152: S2.P$1 179,4 R1.1 178.5,4.5 v178.5,5 | v121,6 121,9.5 | 121,9.5 C3.1 | v112,6 112,5.5 112.5,5 IC1.13 | v172.5,12 v172.5,5.5 | 121,9.5 v122,10.5
  Bottom 0.152: v121,6 v112,6 111,5 110,5 109.5,4.5 101.5,4.5 100.5,3.5 98,3.5 ICSP.5 | v178.5,5 175.5,5 175,5.5 v172.5,5.5 | v172.5,12 161,12 160.5,12.5 141,12.5 139,10.5 v122,10.5
RX  (via drill 0.3)
  Top 0.152: v117.5,1.5 117.5,8 117,8.5 IC1.20 116.5,9 116,9 v115.5,9.5 | v138.5,1 138.5,3 RX.1 | v23.5,33.5 23.5,22 22.5,22 U$3.1 | v93,14 v93,31 | v97,8.5 v97,14
  Bottom 0.152: v117.5,1.5 132,1.5 132.5,1 v138.5,1 | v23.5,33.5 26,33.5 26.5,33 32,33 34,31 v93,31 | v97,14 v93,14 | v97,8.5 98.5,8.5 99.5,9.5 v115.5,9.5
SCK  (via drill 0.3)
  Top 0.152: v108,1.5 108,4.5 108.5,5 IC1.9 | v95,1.5 95,3 ICSP.3
  Bottom 0.152: v95,1.5 v108,1.5
SCL  (via drill 0.3)
  Top 0.152: v177,14 177,8.5 178,7.5 178,7 R22.1 | v123,7 v123,13.5 | v117,7 116,7 IC1.18
  Bottom 0.152: v177,14 170,14 169.5,14.5 137.5,14.5 137,14 129.5,14 129,13.5 v123,13.5 | v117,7 v123,7
SS  (via drill 0.3)
  Top 0.152: v199,49 199,39.5 198,39.5 RXLED.A | v126.5,30.5 v126.5,49 | v116,16 v116,30.5 | v110.5,15 110.5,8 108.5,6 IC1.8
  Bottom 0.152: v126.5,49 v199,49 | v116,30.5 v126.5,30.5 | v116,16 114.5,16 113.5,15 v110.5,15
SUB_PW  (via drill 0.3)
  Top 1.016: IC4.3 58.01,11.51 v58,11.5
  Bottom 1.016: v58,11.5 44,11.5 42.5,13 42.5,14.5 42,15 31.5,15 30.5,16 30.5,24.5 28,27 28,30.06 JP3.2
TX  (via drill 0.3)
  Top 0.152: v116.5,11 v116.5,10 117,9.5 IC1.21 | v138.5,11 138.5,8 TX.1 | v22,15 22,18 U$3.4 | v29,15 29,5.5 31,3.5 v31,1.5 | v49.5,8.5 v49.5,1.5
  Bottom 0.152: v138.5,11 v116.5,11 | v29,15 v22,15 | v49.5,1.5 v31,1.5 | v49.5,8.5 55.5,8.5 56.5,9.5 58.5,9.5 59.5,10.5 89,10.5 89.5,10 v116.5,10
TXA  (via drill 0.3)
  Top 0.152: v197.5,31.5 197.5,35.5 TXLED.A | v187.5,25 v187.5,31.5 | v174,15.5 v174,24.5 | v123.5,9.5 v123.5,15 | v119,10 118.5,9.5 118,9.5 IC1.22
  Bottom 0.152: v187.5,31.5 v197.5,31.5 | v187.5,25 187,24.5 v174,24.5 | v174,15.5 170,15.5 169.5,16 137.5,16 137,15.5 129.5,15.5 129,15 v123.5,15 | v123.5,9.5 121.5,9.5 121,10 v119,10
VBUS  (via drill 0.3)
  Top 0.152: v104,5.5 104,8.5 104.5,9 IC1.2 | v106.5,5.5 107,6 IC1.7 | v35,30.5 v35,29 | v93.5,17 v93.5,30.5 | v102,17 102,14 102.5,13.5 v102.5,5.5 | v189,5.5 189,8.5 F1.2 | v173,15 v173,5
  Top 0.406: F1.2 191.28,8.78 191.5,9 191.5,12.47 JP1.1
  Bottom 0.152: v106.5,5.5 v104,5.5 v102.5,5.5 | v35,29 34.5,29 33.5,30 31,30 JP3.1 | v93.5,30.5 v35,30.5 | v93.5,17 v102,17 102.5,16.5 118,16.5 120,14.5 129,14.5 129.5,15 137,15 137.5,15.5 169.5,15.5 170,15 v173,15 | v189,5.5 188.5,5 179.5,5 179,4.5 175.5,4.5 175,5 v173,5
VIN  (via drill 0.3)
  Top 0.305: C11.+ 75,1.5 74.5,1 v73.5,1 | U$9.1 v52,1
  Top 1.016: U$9.1 52.15,4.15 D1.C 52,10.08 52,12.5 51.5,13 38.5,13 36.18,10.68 X1.2 35.5,10.88 35.5,16 33.5,18 33.5,21.5 28.5,26.5 26.5,26.5 25.53,27.47 JP3.3
  Bottom 0.305: v52,1 v73.5,1
(copper drawn outside any net)
  shapes: Top area x19

### Text on the board
tPlace: NO | NC | NO | NC | NO | NC | NO | NC | NO | NC | NO | NC | VCC | GND | VIN | USB | GND | VCC
200bmp: CENTURION | Multi-Control System | Relay Board